# Altium schematic sheet 4_SD_Card_NFC.SchDoc
size A4; SheetNumber: 4; SheetTotal: 4
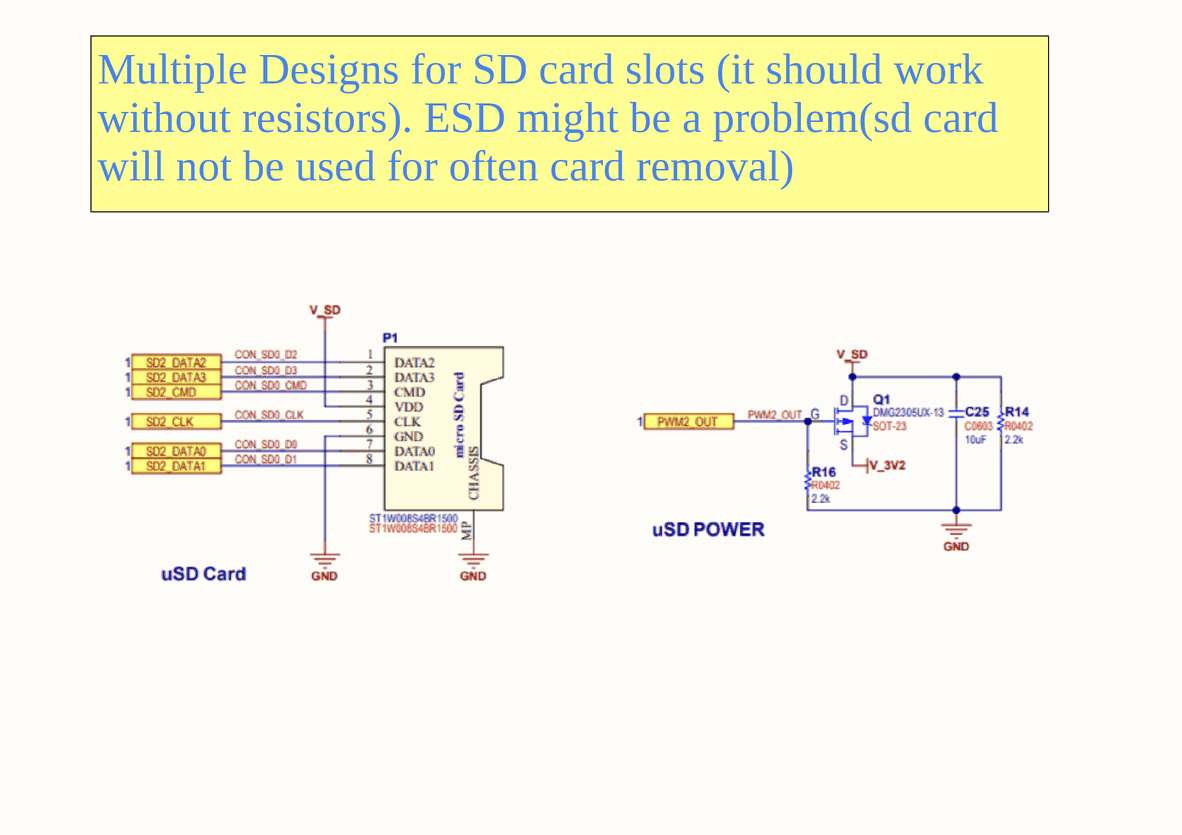
[diagram p0: 4_SD_Card_NFC.SchDoc, top middle]
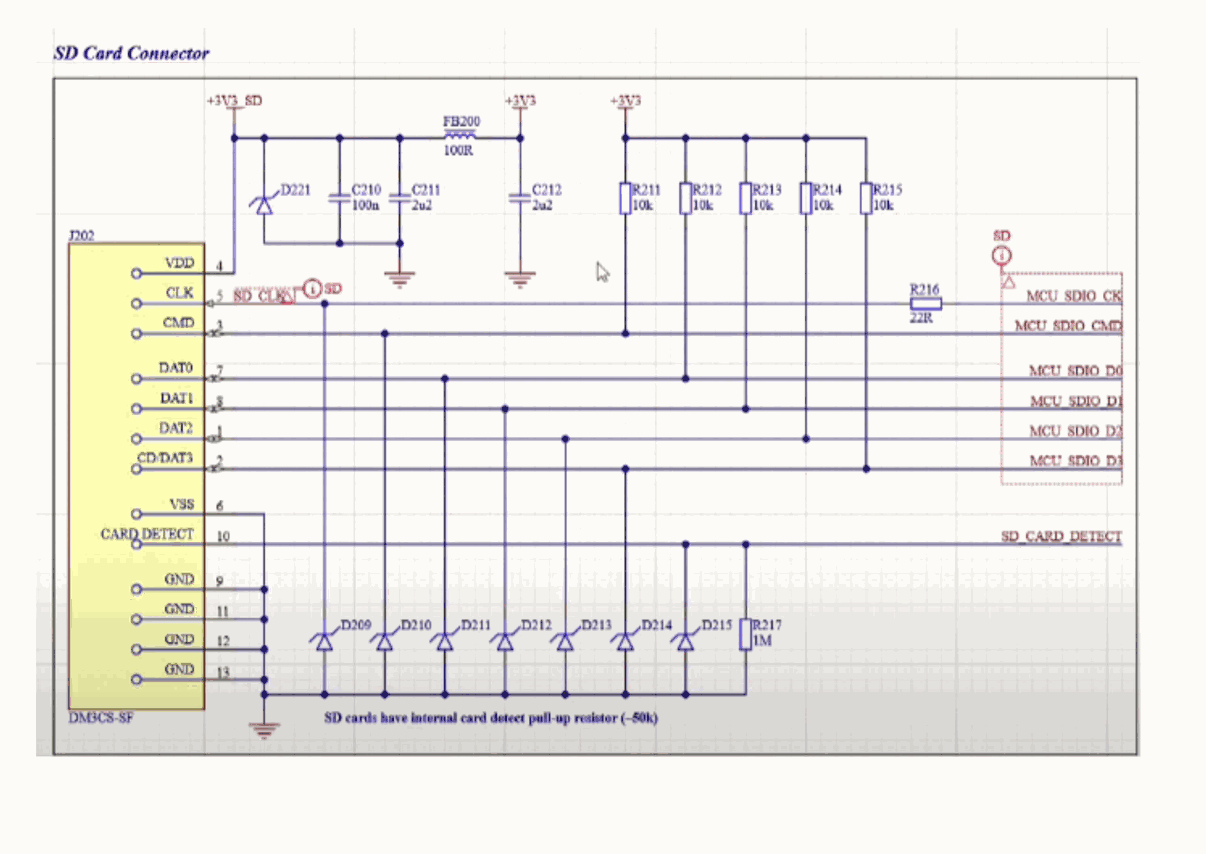
[diagram p1: 4_SD_Card_NFC.SchDoc, bottom left]
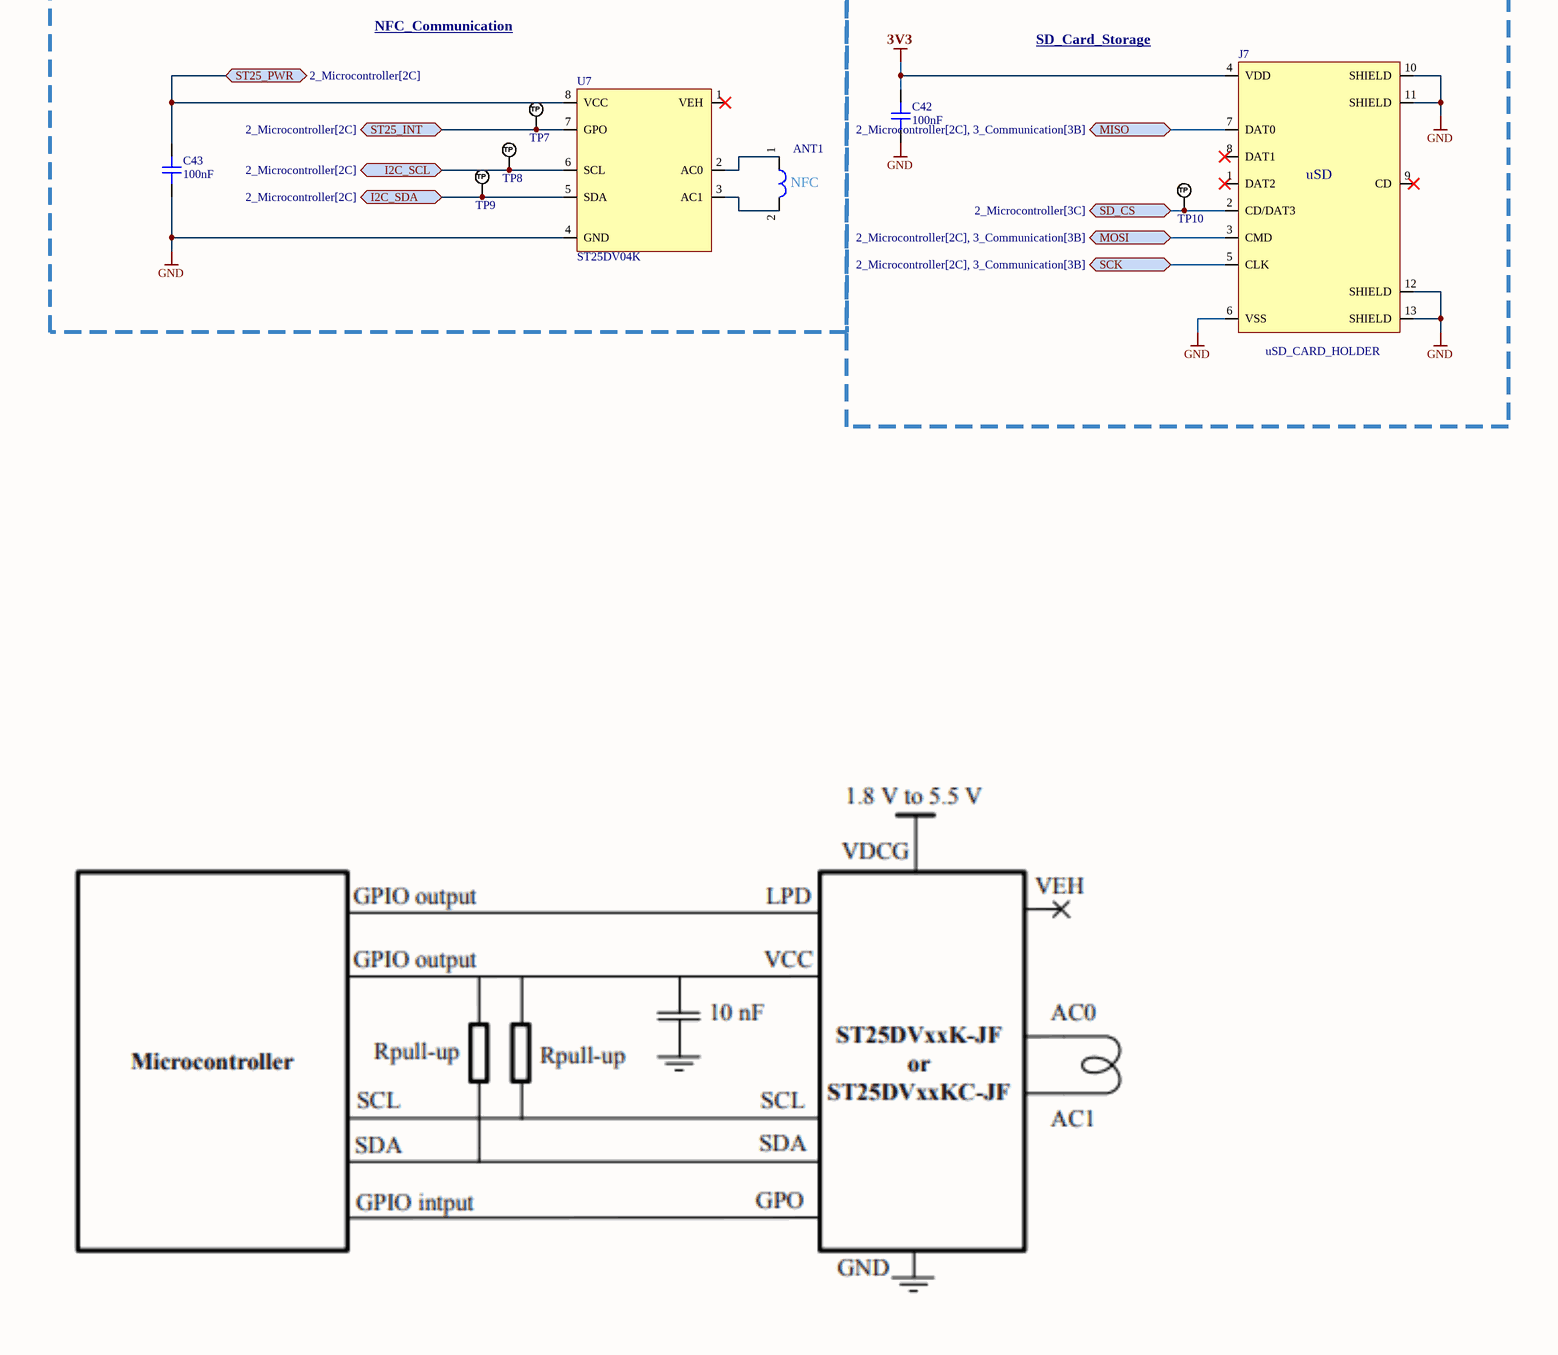
[diagram p2: 4_SD_Card_NFC.SchDoc, bottom middle]
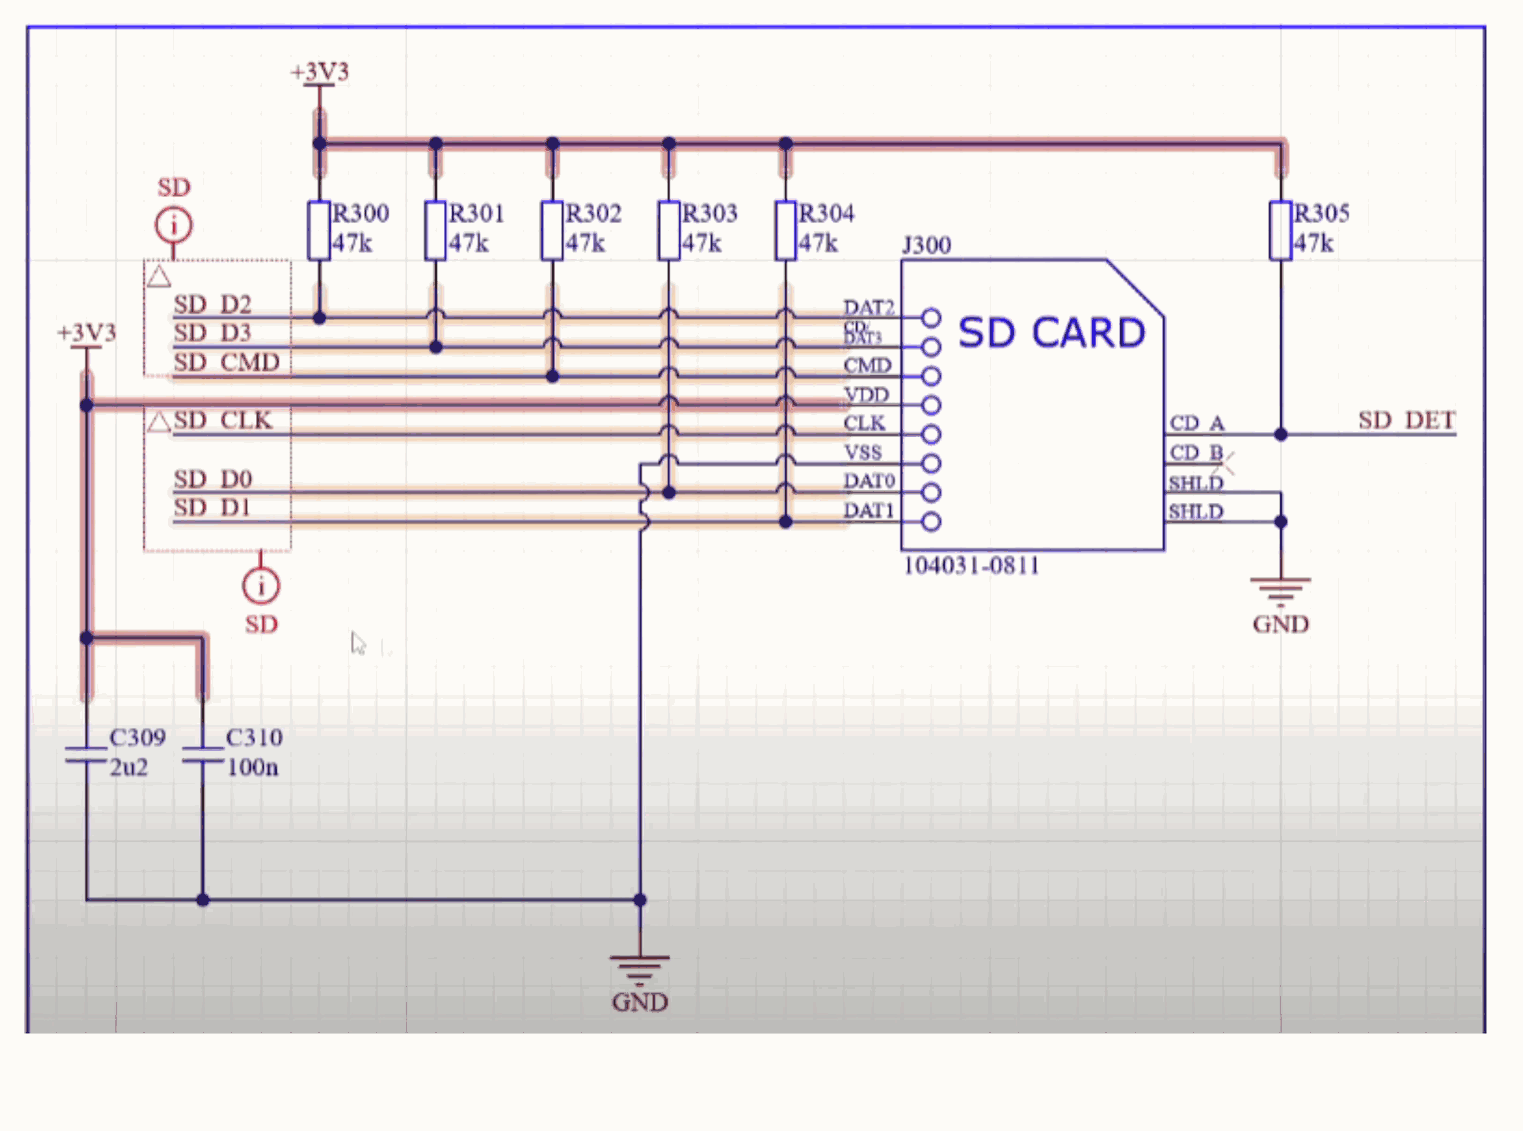
[diagram p3: 4_SD_Card_NFC.SchDoc, bottom right]

## Parts
ANT1  NFC_ANTENNA  [ANT16]  (value not drawn)
C42  100nF  [C0603]
C43  100nF  [C0603]
J7  uSD_CARD_HOLDER  [TF115BCP9]
TP7  TP_NOBOM  [TEST_PAD_THD]  (value not drawn)  (no BOM)
TP8  TP_NOBOM  [TEST_PAD_THD]  (value not drawn)  (no BOM)
TP9  TP_NOBOM  [TEST_PAD_THD]  (value not drawn)  (no BOM)
TP10  TP_NOBOM  [TEST_PAD_THD]  (value not drawn)  (no BOM)
U7  ST25DV04K  [SOIC-SN8_N]

## Ports
I2C_SCL (bidir, see 2_Microcontroller[2C]), I2C_SDA (bidir, see 2_Microcontroller[2C]), MISO (bidir, see 2_Microcontroller[2C], 3_Communication[3B]), MOSI (bidir, see 2_Microcontroller[2C], 3_Communication[3B]), SCK (bidir, see 2_Microcontroller[2C], 3_Communication[3B]), SD_CS (bidir, see 2_Microcontroller[3C]), ST25_INT (bidir, see 2_Microcontroller[2C]), ST25_PWR (bidir, see 2_Microcontroller[2C])

## Nets
3V3: C42.2 J7.4(VDD)
GND: C42.1 C43.1 J7.6(VSS) J7.10(SHIELD) J7.11(SHIELD) J7.12(SHIELD) J7.13(SHIELD) U7.4(GND)
I2C_SCL: TP8.1(TP) U7.6(SCL) ; port I2C_SCL
I2C_SDA: TP9.1(TP) U7.5(SDA) ; port I2C_SDA
MISO: J7.7(DAT0) ; port MISO
MOSI: J7.3(CMD) ; port MOSI
SCK: J7.5(CLK) ; port SCK
SD_CS: J7.2(CD/DAT3) TP10.1(TP) ; port SD_CS
ST25_INT: TP7.1(TP) U7.7(GPO) ; port ST25_INT
ST25_PWR: C43.2 U7.8(VCC) ; port ST25_PWR
NetANT1_1: ANT1.1 U7.2(AC0)
NetANT1_2: ANT1.2 U7.3(AC1)

Not connected (* = marked no-connect by the designer): J7 1(DAT2)* 8(DAT1)* 9(CD)*; U7 1(VEH)*

## Notes on the sheet
- Multiple Designs for SD card slots (it should work without resistors). ESD might be a problem(sd card will not be used for often card removal)
- NFC_Communication
- SD_Card_Storage
- (in symbol NFC_ANTENNA) NFC
- (in symbol uSD_CARD) uSD

## Library data of the parts
C42 C43 = CAP_0603: Capacitor SMD 0603; Manufacturer: *; Manufacturer Part Number: *; Distributor Link: *; LCSC: *; Rating: *; Dielectric: *
J7 = uSD_CARD
TP7-TP10 = TEST_POINT_RND_1MM: Test Point Round 1mm (NO BOM)
U7 = ST25DV04K: ST25DO4K NFC module with I2C